# Altium schematic sheet CC-S07-V00-AnalogueIn.SchDoc: Input Protection (Anagloue)
size A3; DrawnBy: Jonn Dillon; DocumentNumber: 8; SheetNumber: 8; SheetTotal: 13; Project: Chassis Controller (Interim) 2020
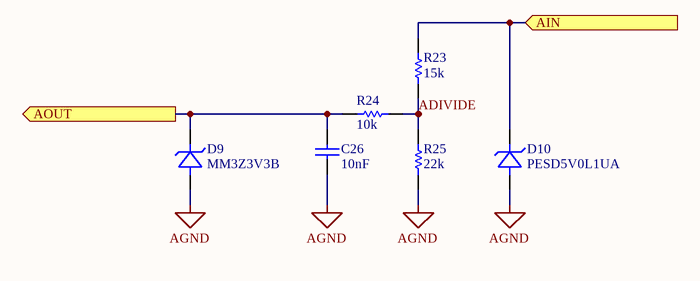
[diagram p0: CC-S07-V00-AnalogueIn.SchDoc]

## Parts
C26  10nF  [Cap_Ceramic_0603]
D9  MM3Z3V3B  [SOD323F]
D10  PESD5V0L1UA  [SOD323F]
R23  15k  [Res_ThinFilm_0603]
R24  10k  [Res_ThinFilm_0603]
R25  22k  [Res_ThinFilm_0603]

## Ports
AIN (in), AOUT (out)

## Nets
AGND: C26.1 D9.A(Anode) D10.A(Anode) R25.1
ADIVIDE: R23.1 R24.2 R25.2
AIN: D10.K(Cathode) R23.2 ; port AIN
AOUT: C26.2 D9.K(Cathode) R24.1 ; port AOUT

## Notes on the sheet
- Revision History:
- Sheet Title:
- Rev
- Date
- Description
- Project:
- Size:
- Drawn By:
- A3
- Number:
- Revision:
- Sheet
- Version:
- of
- QUT Motorsport
- O-120, Gardens Point
- 2 George Street
- Brisbane, QLD 4000
- Australia
- Print Date:
- Print Time:
- File Name:

## Library data of the parts
C26 = 10nF 50V 5% X7R 0603: Capacitor, Ceramic, SMD, 10nF, 50V, 5%, X7R, 0603
D9 = MM3Z3V3B: Diode, SMD, Zenner, 3.3V, 2%, 410mW, SOD-323F; ComponentLink1Description: Digikey; ComponentLink1URL: https://www.digikey.com.au/product-detail/en/on-semiconductor/MM3Z3V3B/MM3Z3V3BCT-ND/1626881
D10 = PESD5V0L1UA: 12V Clamp 3.5A (8/20µs) Ipp Tvs Diode Surface Mount SOD-323
R23 = 15k 5% 0603: Resistor, SMD, 15k, 0.1W, 5%, 0603
R24 = 10k 5% 0603: Resistor, SMD, 10k, 0.1W, 5%, 0603
R25 = 22k 5% 0603: Resistor, SMD, 22k, 0.1W, 5%, 0603